# EAGLE schematic gas_sub_module (EAGLE 7.6.0)
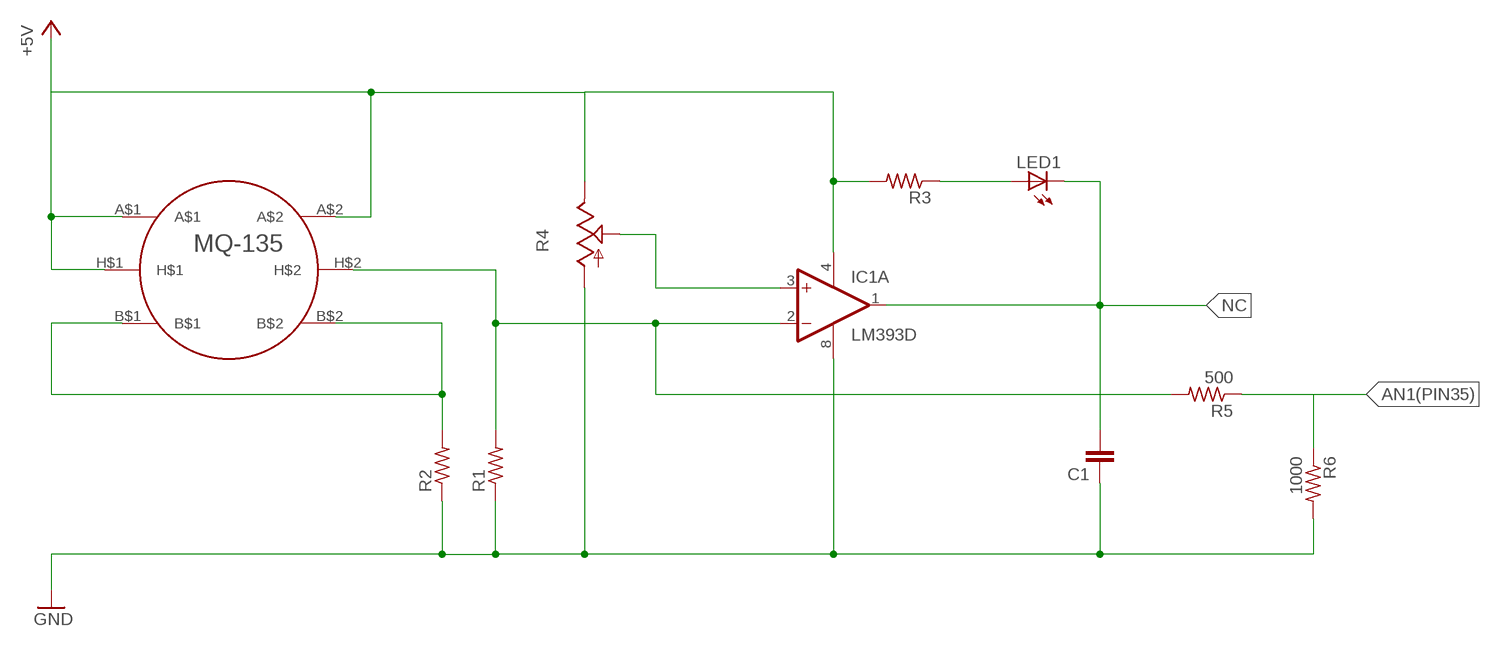
[diagram p0: schematic, sheet 1]

## Parts
C1  C-EU025-025X050  [C025-025X050]
IC1  LM393D  [SO08]
LED1  LAP4-BOTTOM  [P47F-BOTTOM]
R1  R-US_0204/2V  [0204V]
R2  R-US_0204/2V  [0204V]
R3  R-US_0204/2V  [0204V]
R4  TRIM_US-3223G  [3223G]
R5  500  R-US_0204/2V  [0204V]
R6  1000  R-US_0204/2V  [0204V]
U$1  MQ_135_A  [MQ-135]

## Nets
+5V: IC1.4(P:V-) R3.2 R4.3(E) U$1.A$1 U$1.A$2 U$1.H$1
AN0(PIN36): IC1.2(A:-IN) R1.2 R5.2 U$1.H$2
AN1(PIN35): R5.1 R6.1
GND: C1.1 IC1.8(P:V+) R1.1 R2.1 R4.1(A) R6.2
N$3: R2.2 U$1.B$1 U$1.B$2
N$4: IC1.3(A:+IN) R4.2(S)
N$5: LED1.A R3.1
NC: C1.2 IC1.1(A:OUT) LED1.C
Unconnected: IC1.5(B:+IN) IC1.6(B:-IN) IC1.7(B:OUT)

## Library data of the parts
C1 = rcl:C-EU: CAPACITOR, European symbol
IC1 = linear4:LM393: COMPARATOR
LED1 = led:*P4: PointLED® Enhanced Thinfilm LED TOP & BOTTOM mount LS P47F, LR P47F, LA P47F, LY P47F, LT P4SG, LB P4SG, LW P4SG Source: http://catalog.osram-os.com .. LA_LR_LS_LY_P47F_Pb_free.pdf
R1-R3 R5 R6 = rcl:R-US_: RESISTOR, American symbol
R4 = pot:TRIM_US-: POTENTIOMETER
U$1 = MQ_135_A:MQ_135_A